# EAGLE schematic flex_v1 (EAGLE 8.0.0)
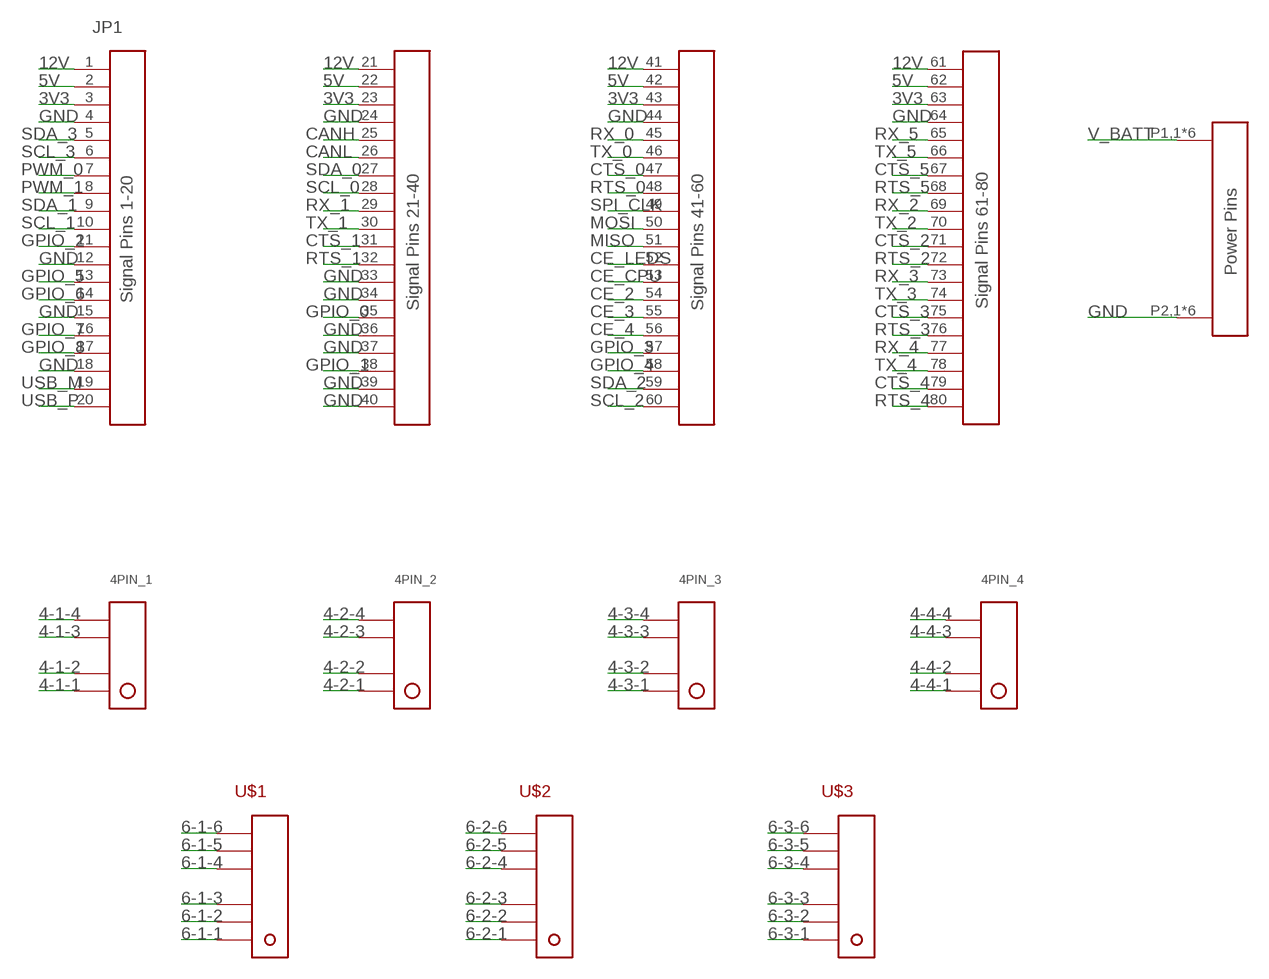
[diagram p0: schematic, sheet 1]

## Parts
4PIN_1  KK254_VERT_4PIN22-29-2041  [KK254_VERT_4PIN]
4PIN_2  KK254_VERT_4PIN22-29-2041  [KK254_VERT_4PIN]
4PIN_3  KK254_VERT_4PIN22-29-2041  [KK254_VERT_4PIN]
4PIN_4  KK254_VERT_4PIN22-29-2041  [KK254_VERT_4PIN]
JP1  MPSC-01-80MPSC-RA-LC  [MPSC-01-80]
U$1  KK254_6PIN  [KK254_6PIN]
U$2  KK254_6PIN  [KK254_6PIN]
U$3  KK254_6PIN  [KK254_6PIN]

## Nets
3V3: JP1.3 JP1.23 JP1.43 JP1.63
4-1-1: 4PIN_1.P$1
4-1-2: 4PIN_1.P$2
4-1-3: 4PIN_1.P$3
4-1-4: 4PIN_1.P$4
4-2-1: 4PIN_2.P$1
4-2-2: 4PIN_2.P$2
4-2-3: 4PIN_2.P$3
4-2-4: 4PIN_2.P$4
4-3-1: 4PIN_3.P$1
4-3-2: 4PIN_3.P$2
4-3-3: 4PIN_3.P$3
4-3-4: 4PIN_3.P$4
4-4-1: 4PIN_4.P$1
4-4-2: 4PIN_4.P$2
4-4-3: 4PIN_4.P$3
4-4-4: 4PIN_4.P$4
5V: JP1.2 JP1.22 JP1.42 JP1.62
6-1-1: U$1.P$1
6-1-2: U$1.P$2
6-1-3: U$1.P$3
6-1-4: U$1.P$4
6-1-5: U$1.P$5
6-1-6: U$1.P$6
6-2-1: U$2.P$1
6-2-2: U$2.P$2
6-2-3: U$2.P$3
6-2-4: U$2.P$4
6-2-5: U$2.P$5
6-2-6: U$2.P$6
6-3-1: U$3.P$1
6-3-2: U$3.P$2
6-3-3: U$3.P$3
6-3-4: U$3.P$4
6-3-5: U$3.P$5
6-3-6: U$3.P$6
12V: JP1.1 JP1.21 JP1.41 JP1.61
CANH: JP1.25
CANL: JP1.26
CE_2: JP1.54
CE_3: JP1.55
CE_4: JP1.56
CE_CPU: JP1.53
CE_LEDS: JP1.52
CTS_0: JP1.47
CTS_1: JP1.31
CTS_2: JP1.71
CTS_3: JP1.75
CTS_4: JP1.79
CTS_5: JP1.67
GND: JP1.4 JP1.12 JP1.15 JP1.18 JP1.24 JP1.33 JP1.34 JP1.36 JP1.37 JP1.39 JP1.40 JP1.44 JP1.64 JP1.P2,1(POWER2) JP1.P2,2(POWER2) JP1.P2,3(POWER2) JP1.P2,4(POWER2) JP1.P2,5(POWER2) JP1.P2,6(POWER2)
GPIO_0: JP1.35
GPIO_1: JP1.38
GPIO_2: JP1.11
GPIO_3: JP1.57
GPIO_4: JP1.58
GPIO_5: JP1.13
GPIO_6: JP1.14
GPIO_7: JP1.16
GPIO_8: JP1.17
MISO: JP1.51
MOSI: JP1.50
PWM_0: JP1.7
PWM_1: JP1.8
RTS_0: JP1.48
RTS_1: JP1.32
RTS_2: JP1.72
RTS_3: JP1.76
RTS_4: JP1.80
RTS_5: JP1.68
RX_0: JP1.45
RX_1: JP1.29
RX_2: JP1.69
RX_3: JP1.73
RX_4: JP1.77
RX_5: JP1.65
SCL_0: JP1.28
SCL_1: JP1.10
SCL_2: JP1.60
SCL_3: JP1.6
SDA_0: JP1.27
SDA_1: JP1.9
SDA_2: JP1.59
SDA_3: JP1.5
SPI_CLK: JP1.49
TX_0: JP1.46
TX_1: JP1.30
TX_2: JP1.70
TX_3: JP1.74
TX_4: JP1.78
TX_5: JP1.66
USB_M: JP1.19
USB_P: JP1.20
V_BATT: JP1.P1,1(POWER1) JP1.P1,2(POWER1) JP1.P1,3(POWER1) JP1.P1,4(POWER1) JP1.P1,5(POWER1) JP1.P1,6(POWER1)

## Library data of the parts
4PIN_1-4PIN_4 = molex:KK254_VERT_4PIN: KK® 254 Wire-to-Board Header, Vertical, with Friction Lock, 4 Circuits, Gold (Au) Plating Part Number: 22-29-2041 http://www.molex.com/molex/products/datasheet.jsp?part=active/0022292041_PCB_HEADERS.xml
JP1 = samtec:MPSC-01-80
U$1-U$3 = molex:KK254_6PIN: Molex KK254 series 6-pin package Datasheet <http://www.molex.com/pdm_docs/sd/022032061_sd.pdf> Link <http://www.molex.com/molex/products/listview.jsp?query=&offset=0&filter=&fs=&npp=20&sType=a&autoNav=&path=+inmeta%3Apromotable%253Dyes+inmeta%3ACollectionName%253DImpulse++inmeta%3Acategory%253DPCB%252520Headers+inmeta%3Abreakaway%253DNo+inmeta%3Acircuitsloaded%253D6%2526partialfields%3D%28productname%3AKK%252520254%29&channel=products>